# Altium schematic sheet RFID.SchDoc: RFID
size 420 x 297 mm; DrawnBy: Hung Vo; SheetNumber: 2; SheetTotal: 5; MasterProject: BTL TKHTN
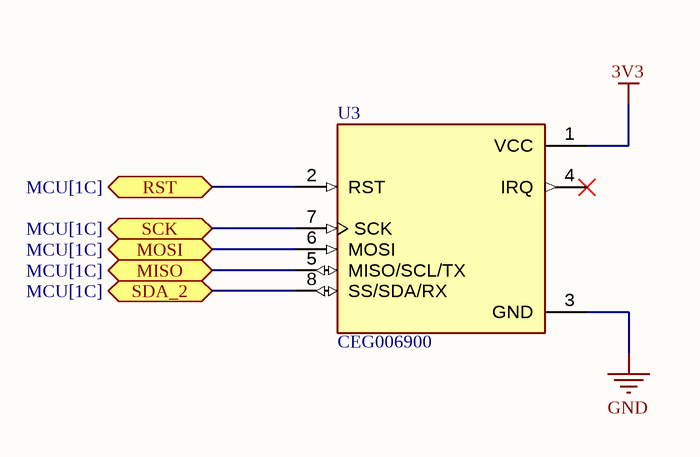
[diagram p0: RFID.SchDoc]

## Parts
U3  CEG006900  [MODULE_CEG006900]

## Ports
MISO (bidir, see MCU[1C]), MOSI (bidir, see MCU[1C]), RST (bidir, see MCU[1C]), SCK (bidir, see MCU[1C]), SDA_2 (bidir, see MCU[1C])

## Nets
3V3: U3.1(VCC)
GND: U3.3(GND)
MISO: U3.5(MISO/SCL/TX) ; port MISO
MOSI: U3.6(MOSI) ; port MOSI
RST: U3.2(RST) ; port RST
SCK: U3.7(SCK) ; port SCK
SDA_2: U3.8(SS/SDA/RX) ; port SDA_2

Not connected (* = marked no-connect by the designer): U3 4(IRQ)*

## Notes on the sheet
- Sub-system:
- Project:
- Design by:
- Sheet title:
- Sheet
- of
- Checked by:
- Approved by:
- Doc No:
- Revision:
- Size:
- Date:
- A3

## Library data of the parts
U3 = CEG006900: RFID RC522 Reader IC Card Module Tags SPI Interface Read and Write; MF: YKS; Value: *; SnapEDA_Link: https://www.snapeda.com/parts/CEG006900/YKS/view-part/?ref=snap; MP: CEG006900; Check_prices: https://www.snapeda.com/parts/CEG006900/YKS/view-part/?ref=eda; Availability: Not in stock; Price: None; Package: None